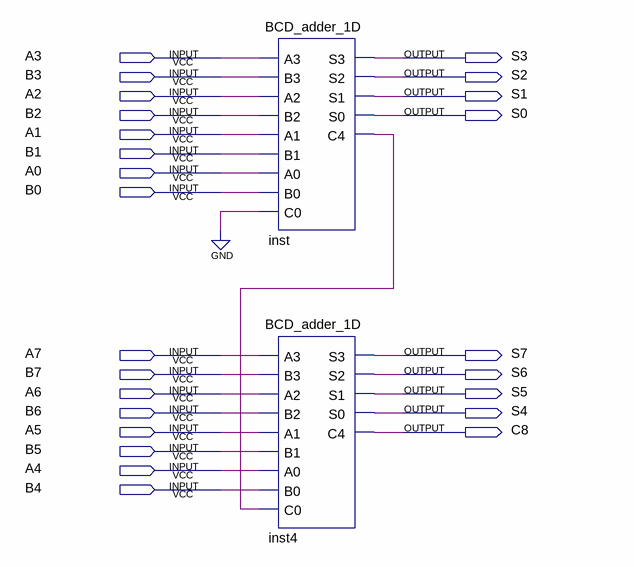
[diagram p0: schematic sheet]
// Quartus schematic BCD_adder_1D_G.bdf as structural Verilog: 2 symbols, 25 pins
module BCD_adder_1D_G (
  input  A3,
  input  B3,
  input  A2,
  input  B2,
  input  A1,
  input  B1,
  input  A0,
  input  B0,
  input  A7,
  input  B7,
  input  A6,
  input  B6,
  input  A5,
  input  B5,
  input  A4,
  input  B4,
  output S3,
  output S2,
  output S1,
  output S0,
  output S7,
  output S6,
  output S5,
  output S4,
  output C8
);

  wire inst_c4;

  BCD_adder_1D inst (
    .A3(A3), .B3(B3), .A2(A2), .B2(B2), .A1(A1), .B1(B1), .A0(A0), .B0(B0), .C0(1'b0), .S3(S3), .S2(S2),
    .S1(S1), .S0(S0), .C4(inst_c4));
  BCD_adder_1D inst4 (
    .A3(A7), .B3(B7), .A2(A6), .B2(B6), .A1(A5), .B1(B5), .A0(A4), .B0(B4), .C0(inst_c4), .S3(S7), .S2(S6),
    .S1(S5), .S0(S4), .C4(C8));
endmodule
